# EasyEDA schematic Projet - SM - Bonne variante.json
TITLE: Sheet_1; REV: 1.0; Date: 2019-12-05; Sheet: 1/1; Drawn By: theomihailescu; Company: Your Company
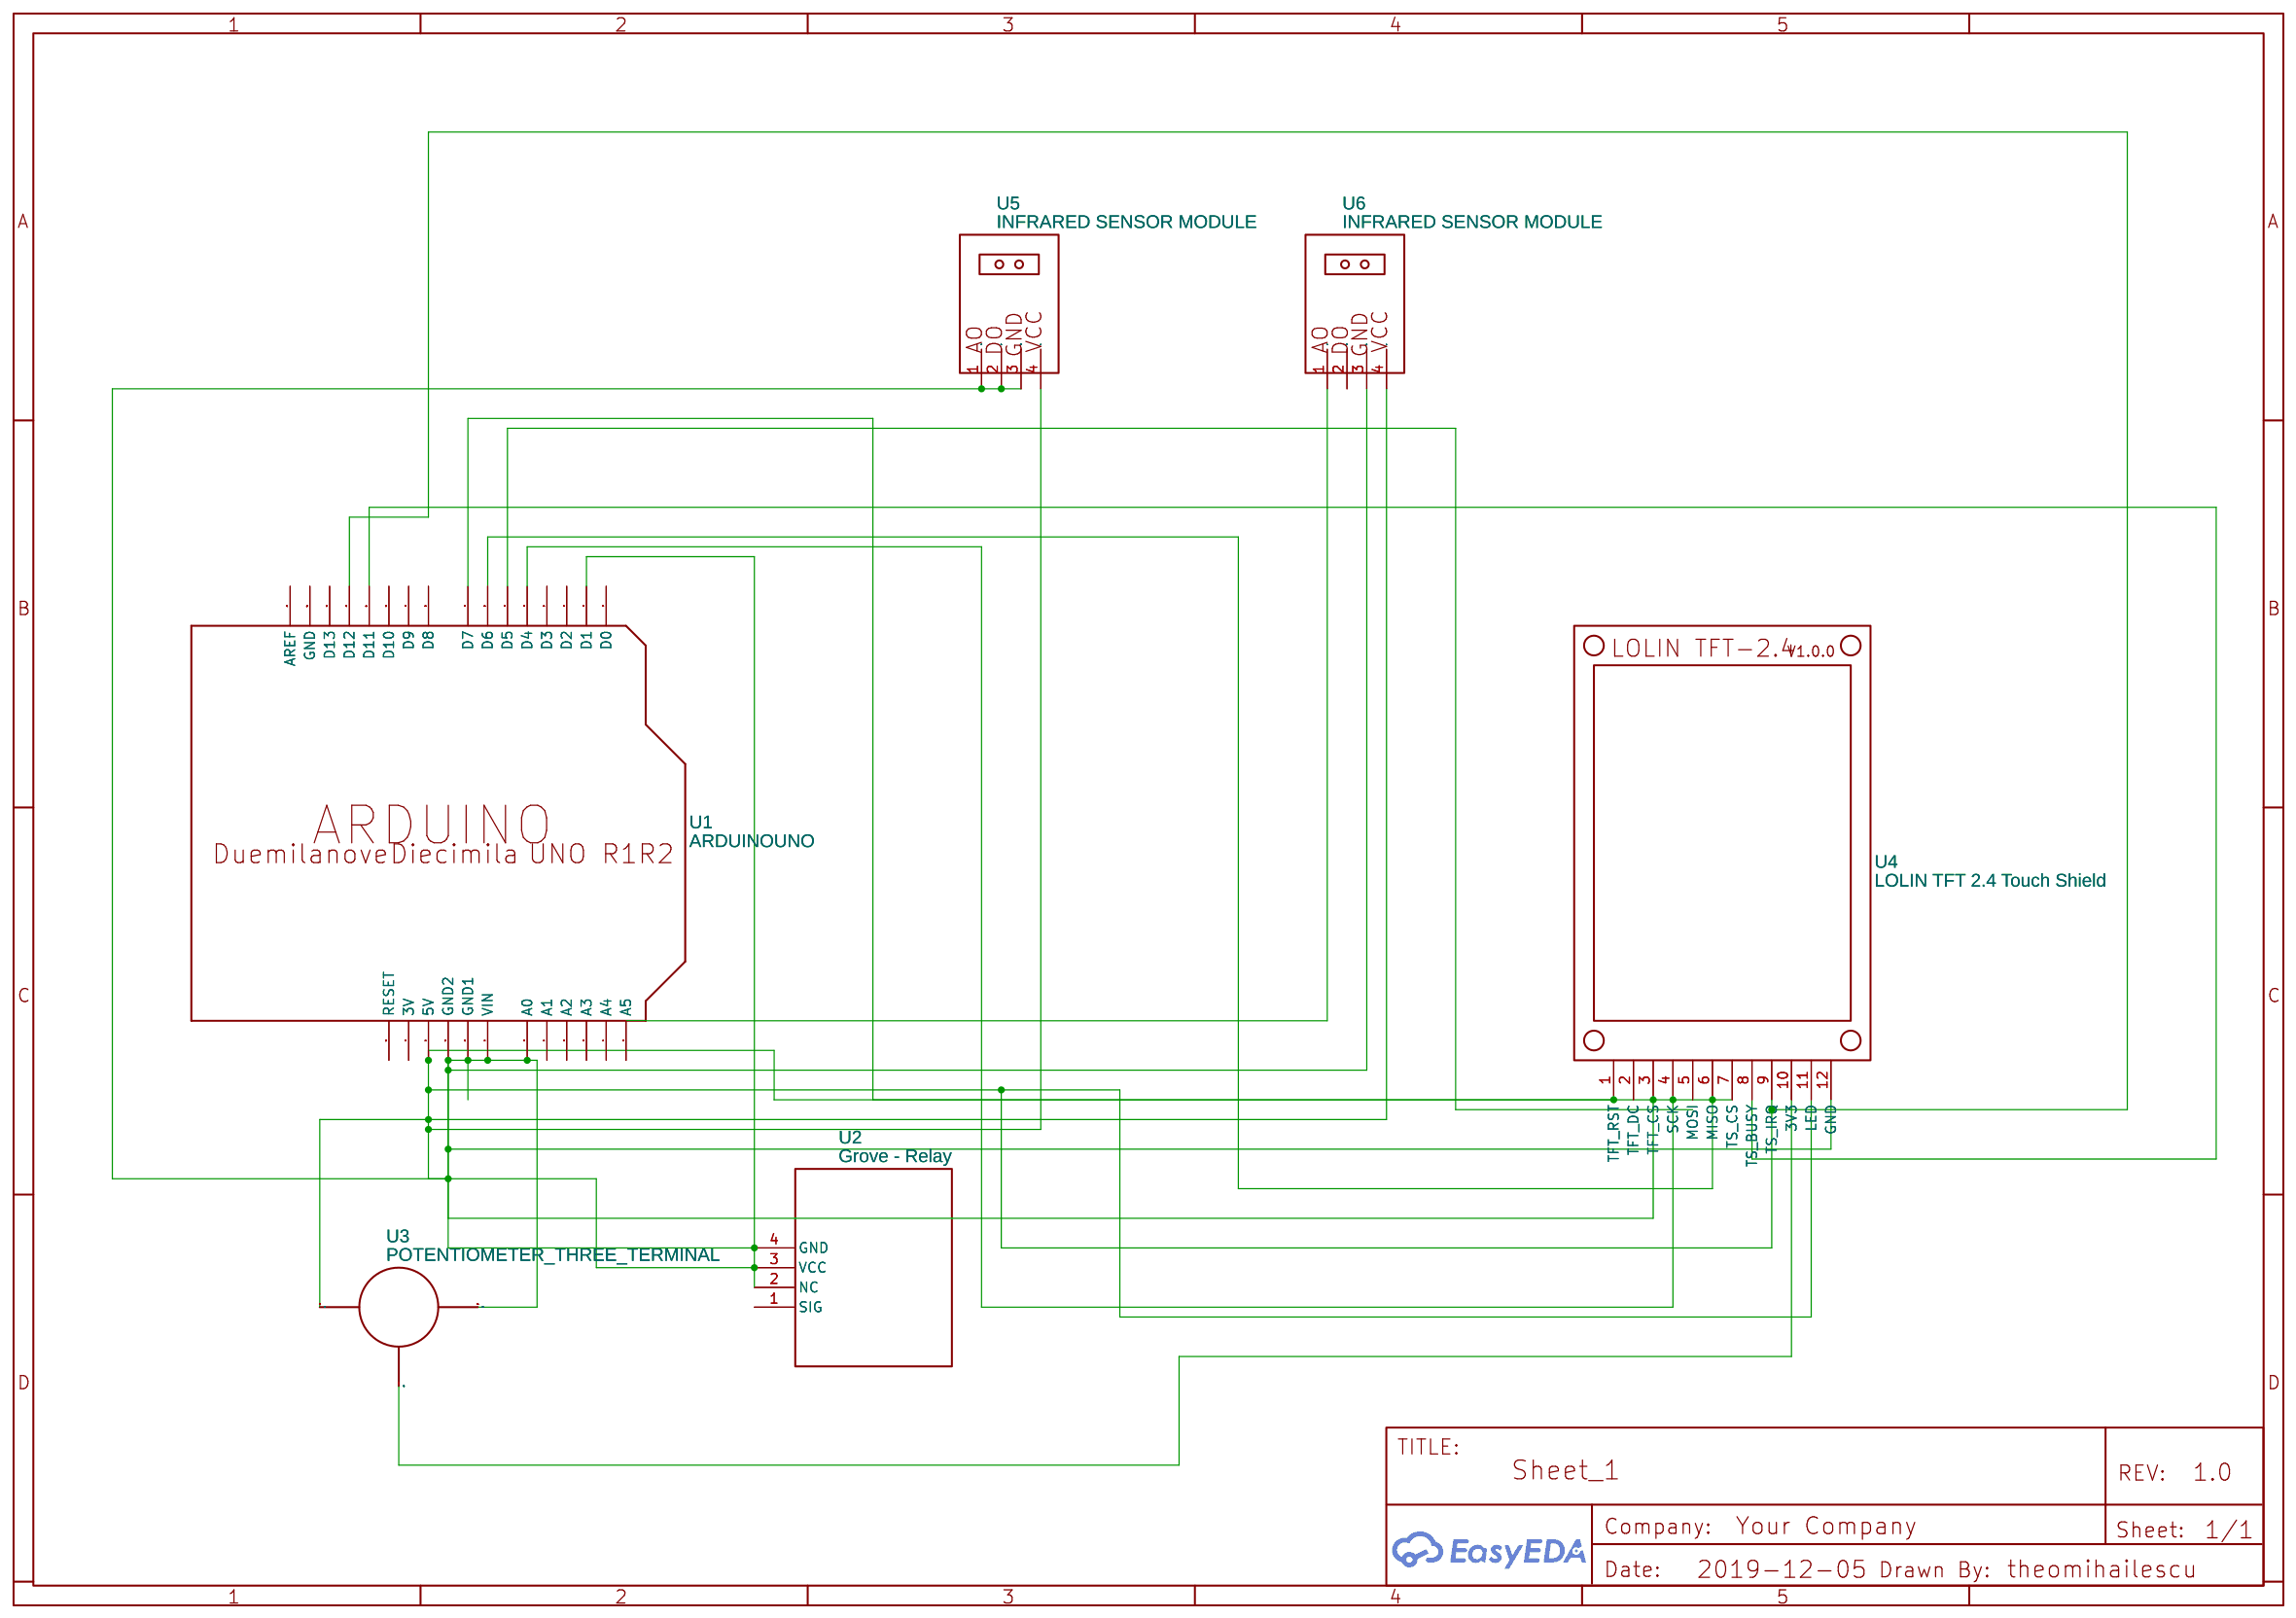
[diagram p0: schematic sheet]

## Parts
#1  -
U1  ARDUINOUNO  [ARDUINO]
U2  Grove - Relay  [GROVE - RELAY]
U3  POTENTIOMETER_THREE_TERMINAL  [THREE_IO]
U4  LOLIN TFT 2.4 Touch Shield
U5  INFRARED SENSOR MODULE  [INFRARED SENSOR MODULE 4 PIN]
U6  INFRARED SENSOR MODULE  [INFRARED SENSOR MODULE 4 PIN]

## Library data of the parts
#1 = -: BOM_Manufacturer Part: ?
U1 = -: Arduino DiecimilaDuemilanove; Contributor: Adafruit
U2 = -: sourceId: pueKgyQ82; Supplier Part: undefined; Supplier: SeeedStudio
U4 = -: link: https://wiki.wemos.cc/products:d1_mini_shields:tft_2.4_shield; Contributor: fabiano.riccardi
U5 U6 = -: Contributor: IICRVx115II

## Nets
Net-(U1-5V): U1.5V U1.A0 U1.D1 U1.D4 U1.D6 U1.D7 U1.D12 U1.GND1 U1.GND2 U1.VIN U2.2(NC) U2.3(VCC) U2.4(GND) U3.P$1 U3.P$2 U5.1 U5.2 U5.3 U5.4 U6.3 U6.4
Net-(U1-A5): U1.A5 U6.1

Not connected (* = marked no-connect by the designer): U1 3V A1 A2 A3 A4 AREF D0 D2 D3 D5 D8 D9 D10 D11 D13 GND RESET; U2 1(SIG); U3 P$3; U4 1(TFT_RST) 2(TFT_DC) 3(TFT_CS) 4(SCK) 5(MOSI) 6(MISO) 7(TS_CS) 8(TS_BUSY) 9(TS_IRQ) 10(3V3) 11(LED) 12(GND); U6 2
